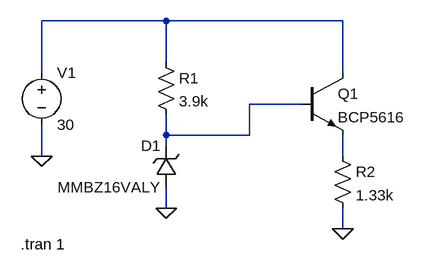
[diagram p0: schematic aux_driver_24V_to_16V_for_slot_optical_switch.asc]
aux_driver_24V_to_16V_for_slot_optical_switch.asc, the LTspice schematic file:
Version 4
SHEET 1 880 680
WIRE 160 -144 -32 -144
WIRE 432 -144 160 -144
WIRE 160 -80 160 -144
WIRE -32 -64 -32 -144
WIRE 432 -64 432 -144
WIRE 368 -16 288 -16
WIRE 160 32 160 0
WIRE 288 32 288 -16
WIRE 288 32 160 32
WIRE 160 48 160 32
WIRE -32 64 -32 16
WIRE 432 64 432 32
WIRE 160 144 160 112
WIRE 432 176 432 144
FLAG 160 144 0
FLAG -32 64 0
FLAG 432 176 0
SYMBOL zener 176 112 R180
WINDOW 0 24 64 Left 2
WINDOW 3 24 0 Left 2
SYMATTR InstName D1
SYMATTR Value MMBZ16VALY
SYMBOL res 144 -96 R0
SYMATTR InstName R1
SYMATTR Value 3.9k
SYMBOL voltage -32 -80 R0
WINDOW 123 0 0 Left 0
WINDOW 39 0 0 Left 0
SYMATTR InstName V1
SYMATTR Value 30
SYMBOL npn 368 -64 R0
SYMATTR InstName Q1
SYMATTR Value BCP5616
SYMBOL res 416 48 R0
SYMATTR InstName R2
SYMATTR Value 1.33k
TEXT -64 200 Left 2 !.tran 1

The netlist it stands for:
* aux_driver_24V_to_16V_for_slot_optical_switch.asc
D1 0 N002 MMBZ16VALY
R1 N001 N002 3.9k
V1 N001 0 30
Q1 N001 N002 N003 0 BCP5616
R2 N003 0 1.33k
.model D D
.lib standard.dio
.model NPN NPN
.model PNP PNP
.lib standard.bjt
.tran 1
.backanno
.end